# Altium schematic sheet RS485-Test.SchDoc: RS485 Interface
size A4; DrawnBy: Marini; DocumentNumber: 2HSGB; Revision: 1.1; SheetNumber: 4; SheetTotal: 13
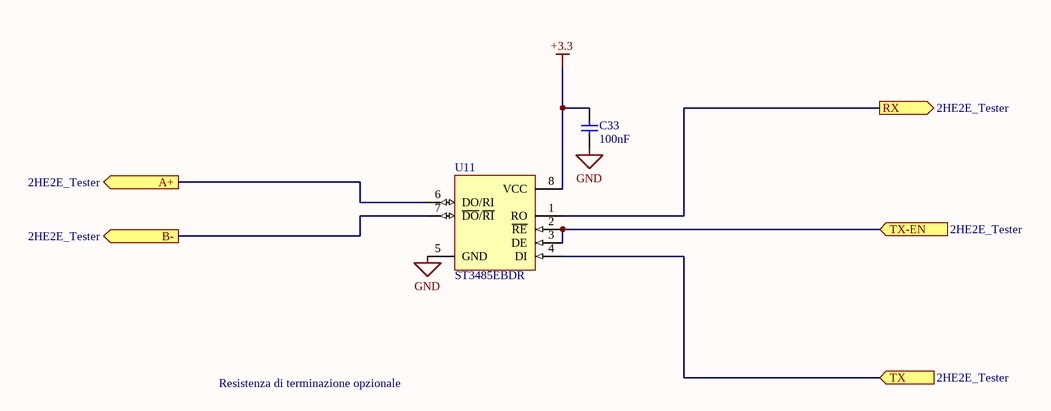
[diagram p0: RS485-Test.SchDoc]

## Parts
C33  value 100nF  [0603M-C]  (hidden comment: Cap Ceramic)
U11  ST3485EBDR  [SOIC127P600-8N]

## Ports
A+ (out, see 2HE2E_Tester), B- (out, see 2HE2E_Tester), RX (out, see 2HE2E_Tester), TX (in, see 2HE2E_Tester), TX-EN (in, see 2HE2E_Tester)

## Nets
+3.3: C33.1 U11.8(VCC)
GND: C33.2 U11.5(GND)
A+: U11.6(DO/RI) ; port A+
B-: U11.7(~{DO}/~{RI}) ; port B-
RX: U11.1(RO) ; port RX
TX: U11.4(DI) ; port TX
TX-EN: U11.2(~{RE}) U11.3(DE) ; port TX-EN

## Notes on the sheet
- Resistenza di terminazione opzionale

## Library data of the parts
C33 = Cap Ceramic: Ceramic Capacitor 25V
U11 = DS75176BM: Multipoint RS-485/RS-422 Transceiver